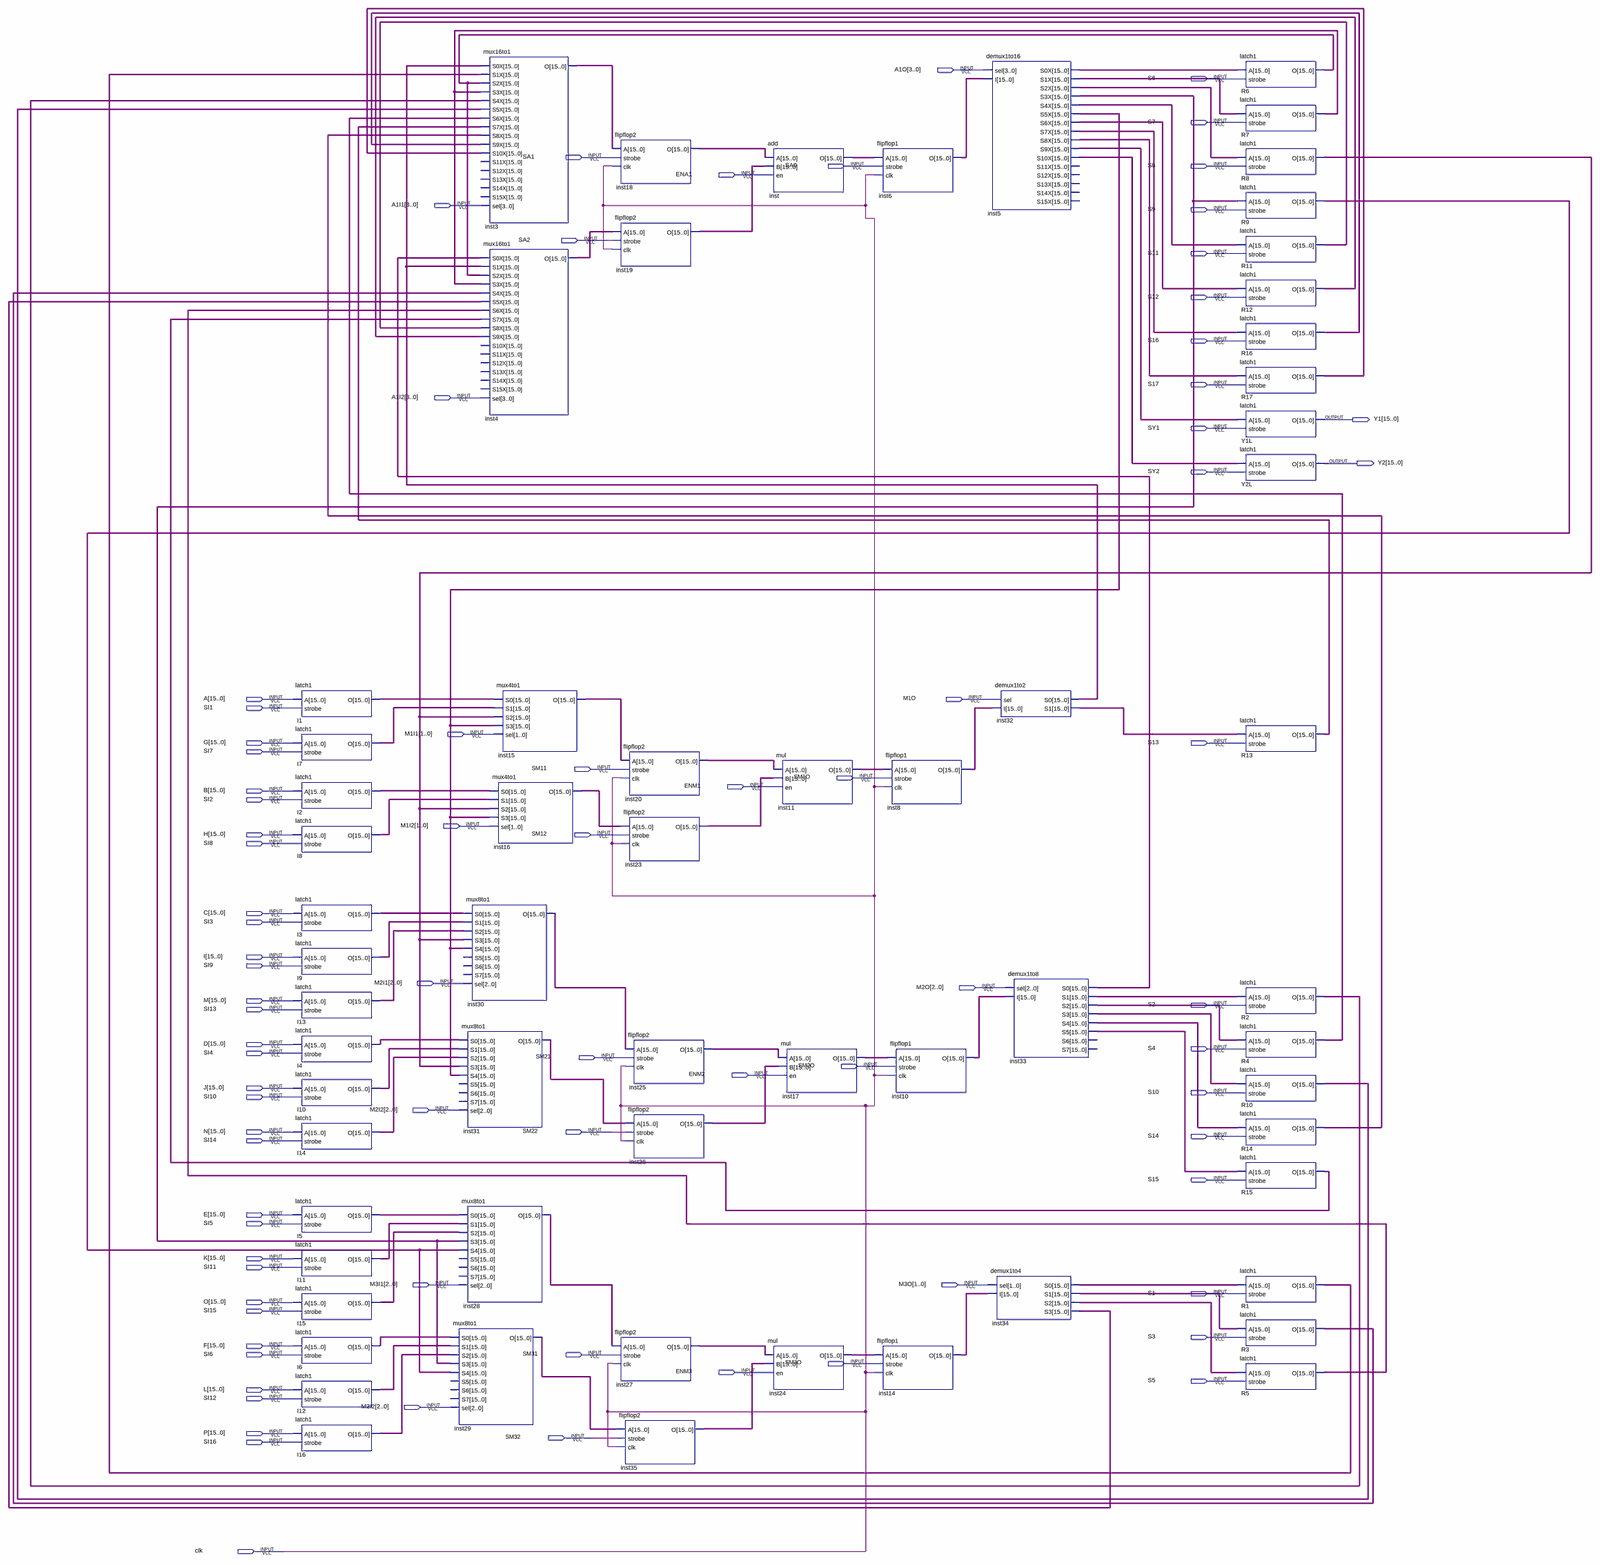
[diagram p0: schematic sheet, whole]
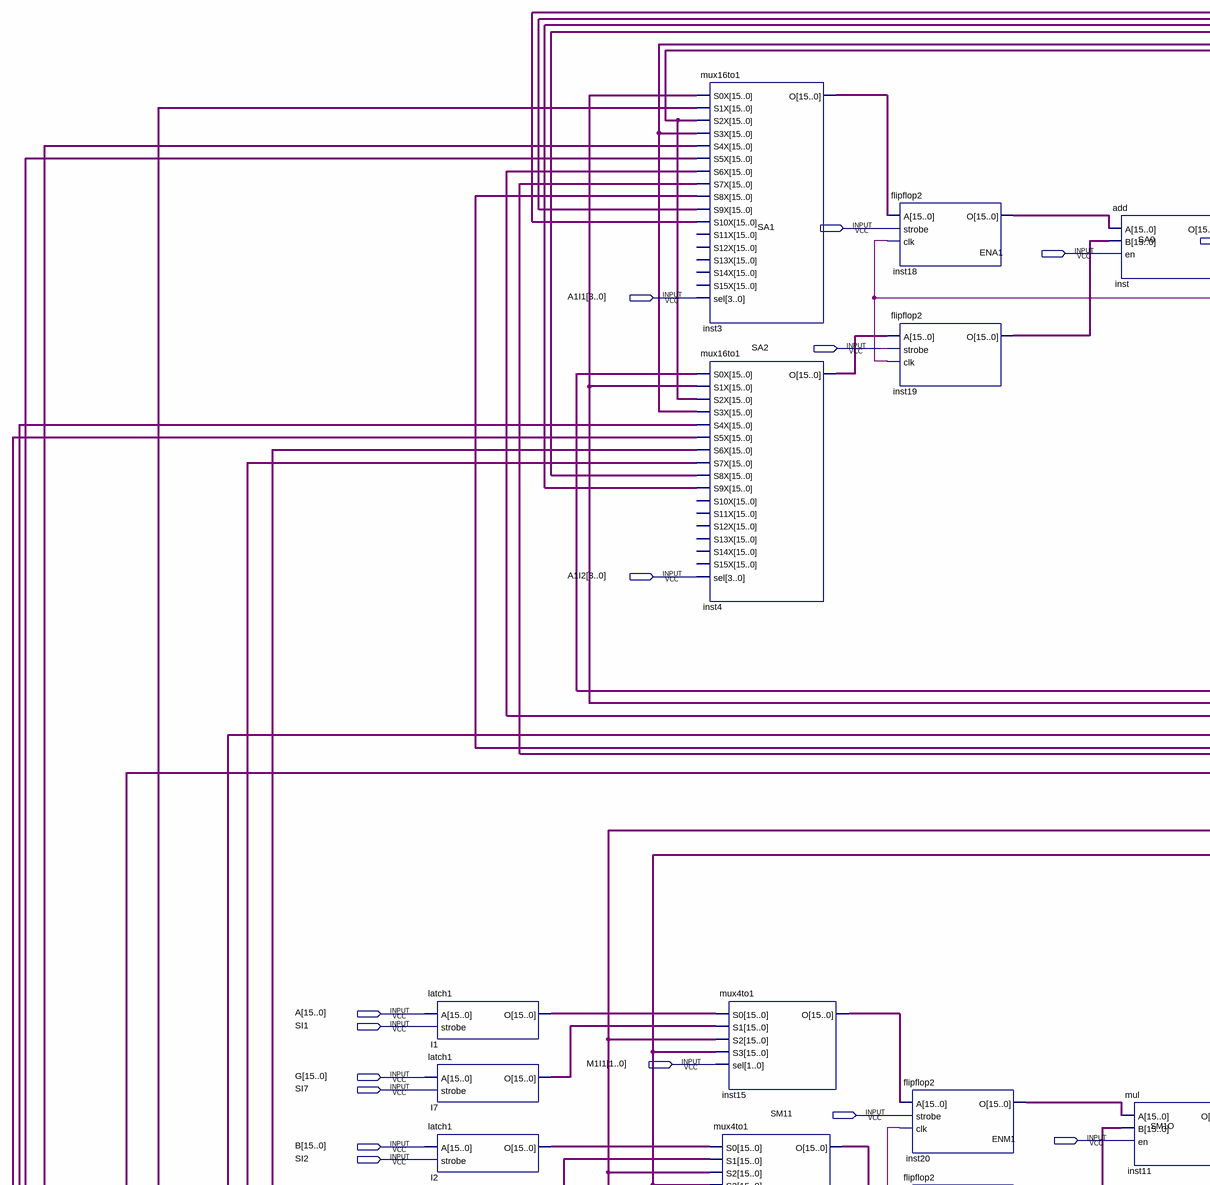
[diagram p1: schematic sheet, upper left part]
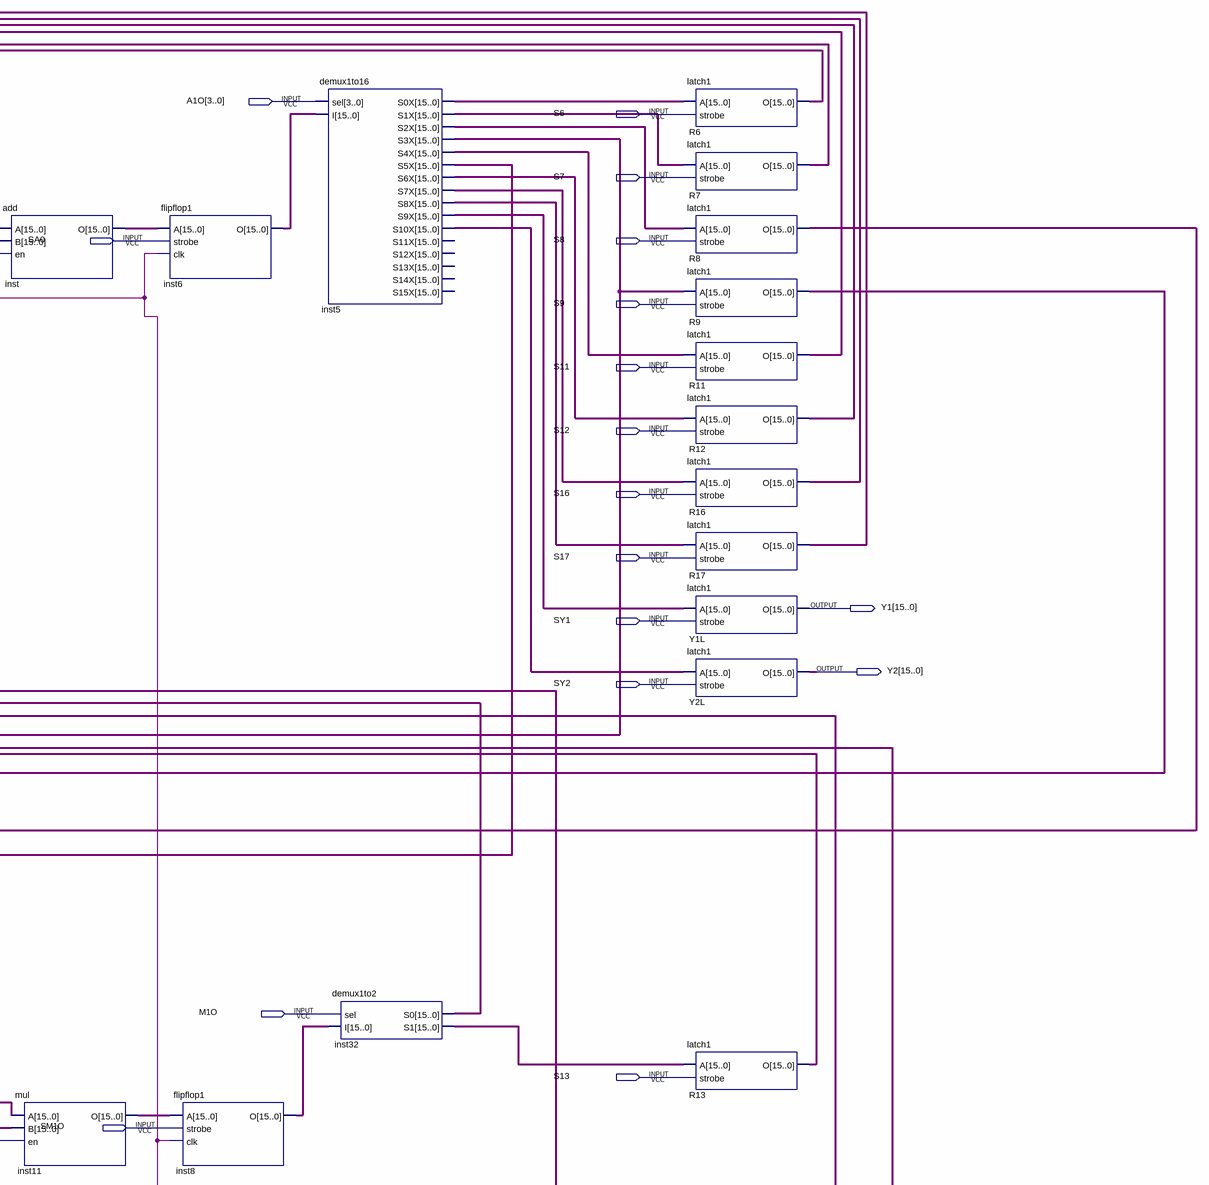
[diagram p2: schematic sheet, upper right part]
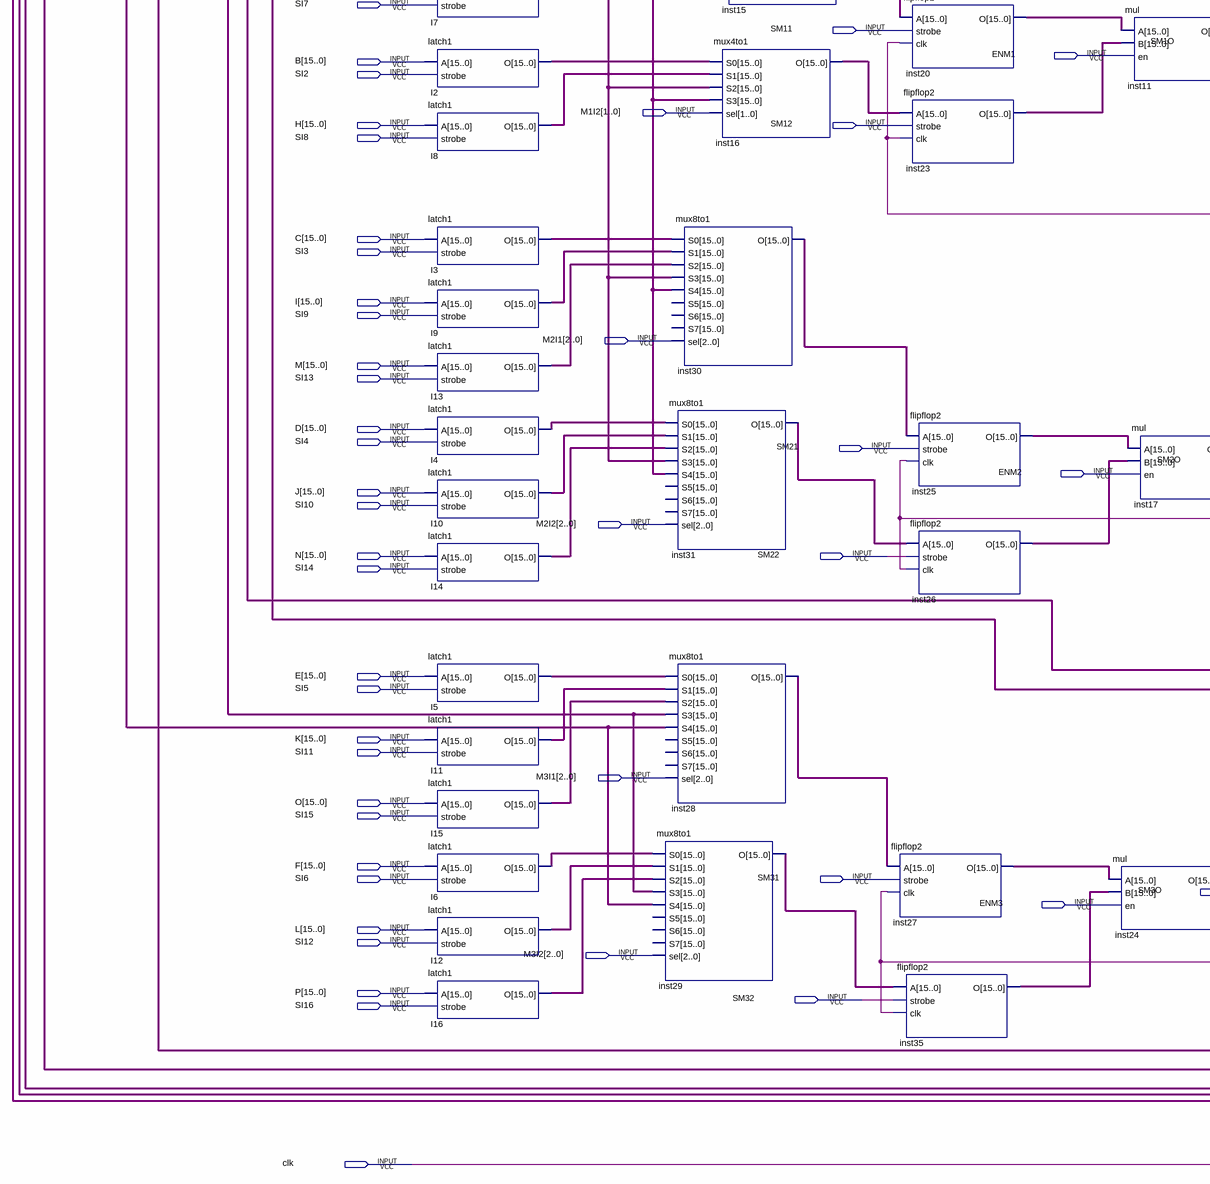
[diagram p3: schematic sheet, lower left part]
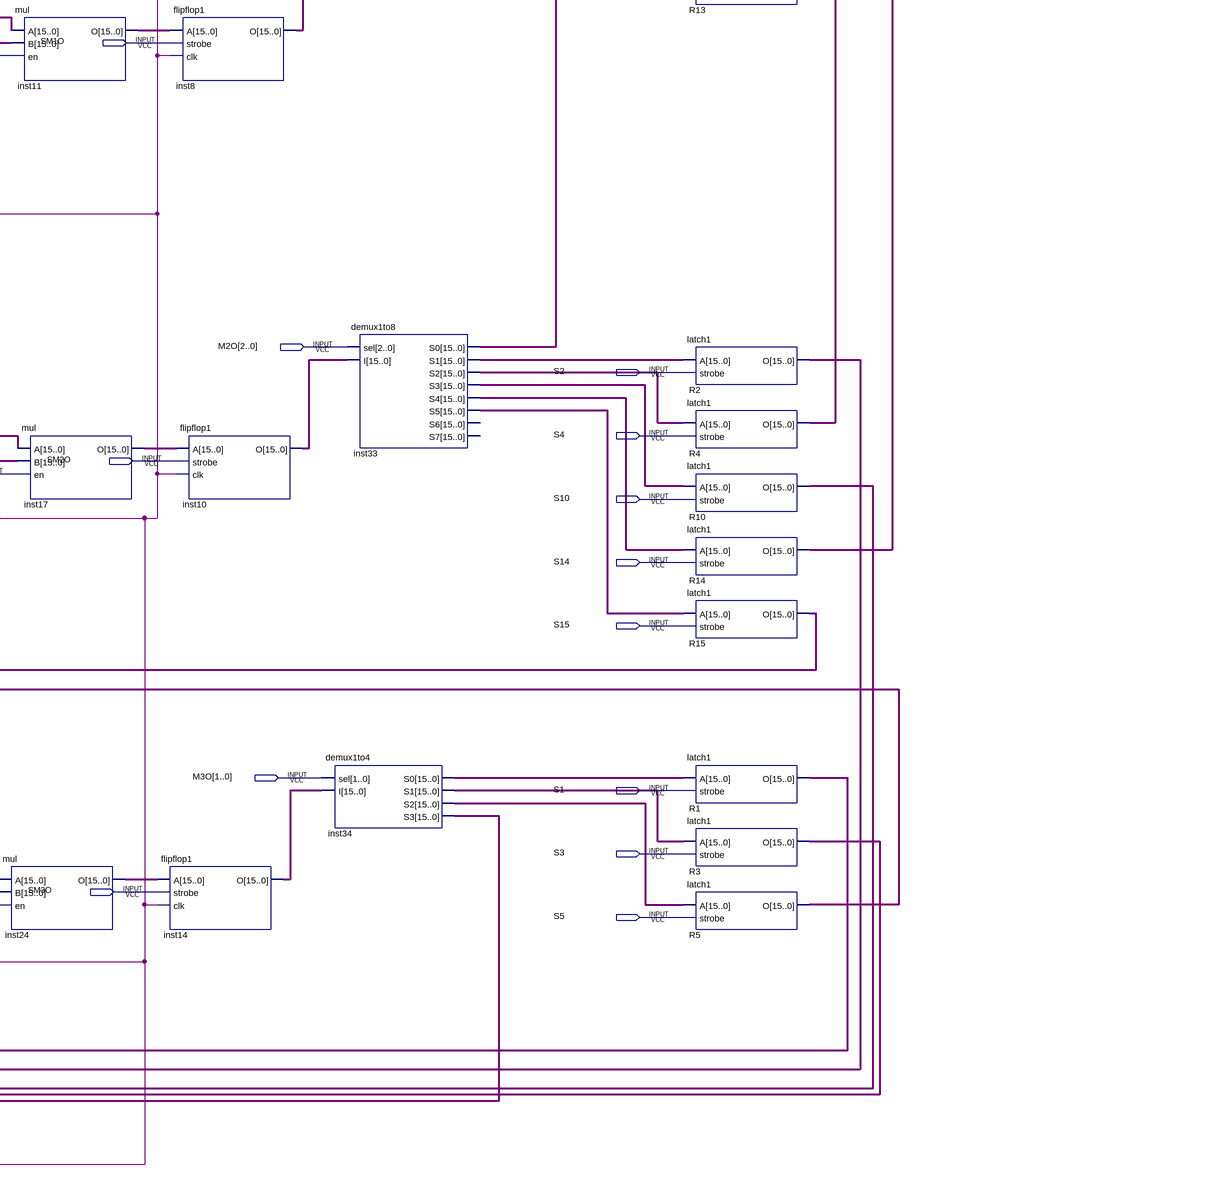
[diagram p4: schematic sheet, lower right part]
// Quartus schematic ARF.bdf as structural Verilog: 63 symbols, 82 pins
module ARF (
  input  [3:0] A1O,
  input  S6,
  input  S7,
  input  SA1,
  input  SA0,
  input  S8,
  input  ENA1,
  input  [3:0] A1I1,
  input  S9,
  input  SA2,
  input  S11,
  input  S12,
  input  S16,
  input  S17,
  input  [3:0] A1I2,
  input  SY1,
  input  SY2,
  input  [15:0] A,
  input  M1O,
  input  SI1,
  input  [1:0] M1I1,
  input  [15:0] G,
  input  S13,
  input  SI7,
  input  SM11,
  input  SM1O,
  input  ENM1,
  input  [15:0] B,
  input  SI2,
  input  [1:0] M1I2,
  input  [15:0] H,
  input  SM12,
  input  SI8,
  input  [15:0] C,
  input  SI3,
  input  [15:0] I,
  input  SI9,
  input  [2:0] M2I1,
  input  [2:0] M2O,
  input  [15:0] M,
  input  S2,
  input  SI13,
  input  [15:0] D,
  input  S4,
  input  SI4,
  input  SM21,
  input  SM2O,
  input  ENM2,
  input  [15:0] J,
  input  S10,
  input  SI10,
  input  [2:0] M2I2,
  input  [15:0] N,
  input  SM22,
  input  S14,
  input  SI14,
  input  S15,
  input  [15:0] E,
  input  SI5,
  input  [15:0] K,
  input  SI11,
  input  [2:0] M3I1,
  input  [1:0] M3O,
  input  S1,
  input  [15:0] O,
  input  SI15,
  input  S3,
  input  [15:0] F,
  input  SI6,
  input  SM31,
  input  SM3O,
  input  ENM3,
  input  S5,
  input  [15:0] L,
  input  SI12,
  input  [2:0] M3I2,
  input  [15:0] P,
  input  SM32,
  input  SI16,
  input  clk,
  output [15:0] Y1,
  output [15:0] Y2
);

  wire [15:0] I1_o, I2_o, I3_o, I4_o, I5_o, I6_o, I7_o, I8_o, I9_o, I10_o, I11_o, I12_o, I13_o, I14_o, I15_o,
       I16_o, inst3_o, inst4_o, inst5_s0x, inst5_s1x, inst5_s2x, inst5_s3x, inst5_s4x, inst5_s5x, inst5_s6x,
       inst5_s7x, inst5_s8x, inst5_s9x, inst5_s10x, inst6_o, inst8_o, inst10_o, inst11_o, inst14_o, inst15_o,
       inst16_o, inst17_o, inst18_o, inst19_o, inst20_o, inst23_o, inst24_o, inst25_o, inst26_o, inst27_o,
       inst28_o, inst29_o, inst30_o, inst31_o, inst32_s0, inst32_s1, inst33_s0, inst33_s1, inst33_s2,
       inst33_s3, inst33_s4, inst33_s5, inst34_s0, inst34_s1, inst34_s2, inst34_s3, inst35_o, inst_o, R1_o,
       R2_o, R3_o, R4_o, R5_o, R6_o, R7_o, R8_o, R9_o, R10_o, R11_o, R12_o, R13_o, R14_o, R15_o, R16_o, R17_o;

  latch1 I1 (.A(A), .strobe(SI1), .O(I1_o));
  latch1 I7 (.A(G), .strobe(SI7), .O(I7_o));
  latch1 I2 (.A(B), .strobe(SI2), .O(I2_o));
  latch1 I8 (.A(H), .strobe(SI8), .O(I8_o));
  latch1 I3 (.A(C), .strobe(SI3), .O(I3_o));
  latch1 I9 (.A(I), .strobe(SI9), .O(I9_o));
  latch1 I13 (.A(M), .strobe(SI13), .O(I13_o));
  latch1 I4 (.A(D), .strobe(SI4), .O(I4_o));
  latch1 I10 (.A(J), .strobe(SI10), .O(I10_o));
  latch1 I14 (.A(N), .strobe(SI14), .O(I14_o));
  latch1 I5 (.A(E), .strobe(SI5), .O(I5_o));
  latch1 I11 (.A(K), .strobe(SI11), .O(I11_o));
  latch1 I15 (.A(O), .strobe(SI15), .O(I15_o));
  latch1 I6 (.A(F), .strobe(SI6), .O(I6_o));
  latch1 I12 (.A(L), .strobe(SI12), .O(I12_o));
  latch1 I16 (.A(P), .strobe(SI16), .O(I16_o));
  mux16to1 inst3 (
    .S0X(inst32_s0), .S1X(R1_o), .S2X(R6_o), .S3X(R7_o), .S4X(R2_o), .S5X(R10_o), .S6X(R4_o), .S7X(R13_o),
    .S8X(R14_o), .S9X(R16_o), .S10X(R17_o), .sel(A1I1), .O(inst3_o));  // open: S11X, S12X, S13X, S14X, S15X
  mux16to1 inst4 (
    .S0X(inst33_s0), .S1X(inst32_s0), .S2X(R6_o), .S3X(R7_o), .S4X(R3_o), .S5X(inst34_s3), .S6X(R5_o),
    .S7X(R15_o), .S8X(R11_o), .S9X(R12_o), .sel(A1I2), .O(inst4_o));  // open: S10X, S11X, S12X, S13X, S14X, S15X
  mux8to1 inst30 (
    .S0(I3_o), .S1(I9_o), .S2(I13_o), .S3(R8_o), .S4(inst5_s5x), .sel(M2I1), .O(inst30_o));  // open: S5, S6, S7
  mux8to1 inst31 (
    .S0(I4_o), .S1(I10_o), .S2(I14_o), .S3(R8_o), .S4(inst5_s5x), .sel(M2I2), .O(inst31_o));  // open: S5, S6, S7
  mux8to1 inst28 (
    .S0(I5_o), .S1(I11_o), .S2(I15_o), .S3(inst5_s3x), .S4(R9_o), .sel(M3I1), .O(inst28_o));  // open: S5, S6, S7
  mux8to1 inst29 (
    .S0(I6_o), .S1(I12_o), .S2(I16_o), .S3(inst5_s3x), .S4(R9_o), .sel(M3I2), .O(inst29_o));  // open: S5, S6, S7
  mux4to1 inst15 (.S0(I1_o), .S1(I7_o), .S2(R8_o), .S3(inst5_s5x), .sel(M1I1), .O(inst15_o));
  mux4to1 inst16 (.S0(I2_o), .S1(I8_o), .S2(R8_o), .S3(inst5_s5x), .sel(M1I2), .O(inst16_o));
  flipflop2 inst18 (.A(inst3_o), .strobe(SA1), .clk(clk), .O(inst18_o));
  flipflop2 inst19 (.A(inst4_o), .strobe(SA2), .clk(clk), .O(inst19_o));
  flipflop2 inst20 (.A(inst15_o), .strobe(SM11), .clk(clk), .O(inst20_o));
  flipflop2 inst23 (.A(inst16_o), .strobe(SM12), .clk(clk), .O(inst23_o));
  flipflop2 inst27 (.A(inst28_o), .strobe(SM31), .clk(clk), .O(inst27_o));
  flipflop2 inst35 (.A(inst29_o), .strobe(SM32), .clk(clk), .O(inst35_o));
  flipflop2 inst25 (.A(inst30_o), .strobe(SM21), .clk(clk), .O(inst25_o));
  flipflop2 inst26 (.A(inst31_o), .strobe(SM22), .clk(clk), .O(inst26_o));
  add inst (.A(inst18_o), .B(inst19_o), .en(ENA1), .O(inst_o));
  mul inst11 (.A(inst20_o), .B(inst23_o), .en(ENM1), .O(inst11_o));
  mul inst17 (.A(inst25_o), .B(inst26_o), .en(ENM2), .O(inst17_o));
  mul inst24 (.A(inst27_o), .B(inst35_o), .en(ENM3), .O(inst24_o));
  flipflop1 inst6 (.A(inst_o), .strobe(SA0), .clk(clk), .O(inst6_o));
  flipflop1 inst8 (.A(inst11_o), .strobe(SM1O), .clk(clk), .O(inst8_o));
  flipflop1 inst10 (.A(inst17_o), .strobe(SM2O), .clk(clk), .O(inst10_o));
  flipflop1 inst14 (.A(inst24_o), .strobe(SM3O), .clk(clk), .O(inst14_o));
  demux1to16 inst5 (
    .sel(A1O), .I(inst6_o), .S0X(inst5_s0x), .S1X(inst5_s1x), .S2X(inst5_s2x), .S3X(inst5_s3x),
    .S4X(inst5_s4x), .S5X(inst5_s5x), .S6X(inst5_s6x), .S7X(inst5_s7x), .S8X(inst5_s8x), .S9X(inst5_s9x),
    .S10X(inst5_s10x));  // open: S11X, S12X, S13X, S14X, S15X
  demux1to2 inst32 (.sel(M1O), .I(inst8_o), .S0(inst32_s0), .S1(inst32_s1));
  demux1to8 inst33 (
    .sel(M2O), .I(inst10_o), .S0(inst33_s0), .S1(inst33_s1), .S2(inst33_s2), .S3(inst33_s3), .S4(inst33_s4),
    .S5(inst33_s5));  // open: S6, S7
  demux1to4 inst34 (.sel(M3O), .I(inst14_o), .S0(inst34_s0), .S1(inst34_s1), .S2(inst34_s2), .S3(inst34_s3));
  latch1 R6 (.A(inst5_s0x), .strobe(S6), .O(R6_o));
  latch1 R7 (.A(inst5_s1x), .strobe(S7), .O(R7_o));
  latch1 R8 (.A(inst5_s2x), .strobe(S8), .O(R8_o));
  latch1 R9 (.A(inst5_s3x), .strobe(S9), .O(R9_o));
  latch1 R11 (.A(inst5_s4x), .strobe(S11), .O(R11_o));
  latch1 R12 (.A(inst5_s6x), .strobe(S12), .O(R12_o));
  latch1 R16 (.A(inst5_s7x), .strobe(S16), .O(R16_o));
  latch1 R17 (.A(inst5_s8x), .strobe(S17), .O(R17_o));
  latch1 Y1L (.A(inst5_s9x), .strobe(SY1), .O(Y1));
  latch1 Y2L (.A(inst5_s10x), .strobe(SY2), .O(Y2));
  latch1 R13 (.A(inst32_s1), .strobe(S13), .O(R13_o));
  latch1 R2 (.A(inst33_s1), .strobe(S2), .O(R2_o));
  latch1 R4 (.A(inst33_s2), .strobe(S4), .O(R4_o));
  latch1 R10 (.A(inst33_s3), .strobe(S10), .O(R10_o));
  latch1 R14 (.A(inst33_s4), .strobe(S14), .O(R14_o));
  latch1 R15 (.A(inst33_s5), .strobe(S15), .O(R15_o));
  latch1 R1 (.A(inst34_s0), .strobe(S1), .O(R1_o));
  latch1 R3 (.A(inst34_s1), .strobe(S3), .O(R3_o));
  latch1 R5 (.A(inst34_s2), .strobe(S5), .O(R5_o));
endmodule
